# EasyEDA Pro project ActiveMoCapDeck.eprj

# Schematic ActivaMoCapDeck
Board Name: ActiveMoCapDeck; Create Date: 2024-09-30; Page Name: sch_1; Project Name: ActiveMoCapDeck_shrink; Schematic Name: ActivaMoCapDeck; Update Date: 2024-10-02
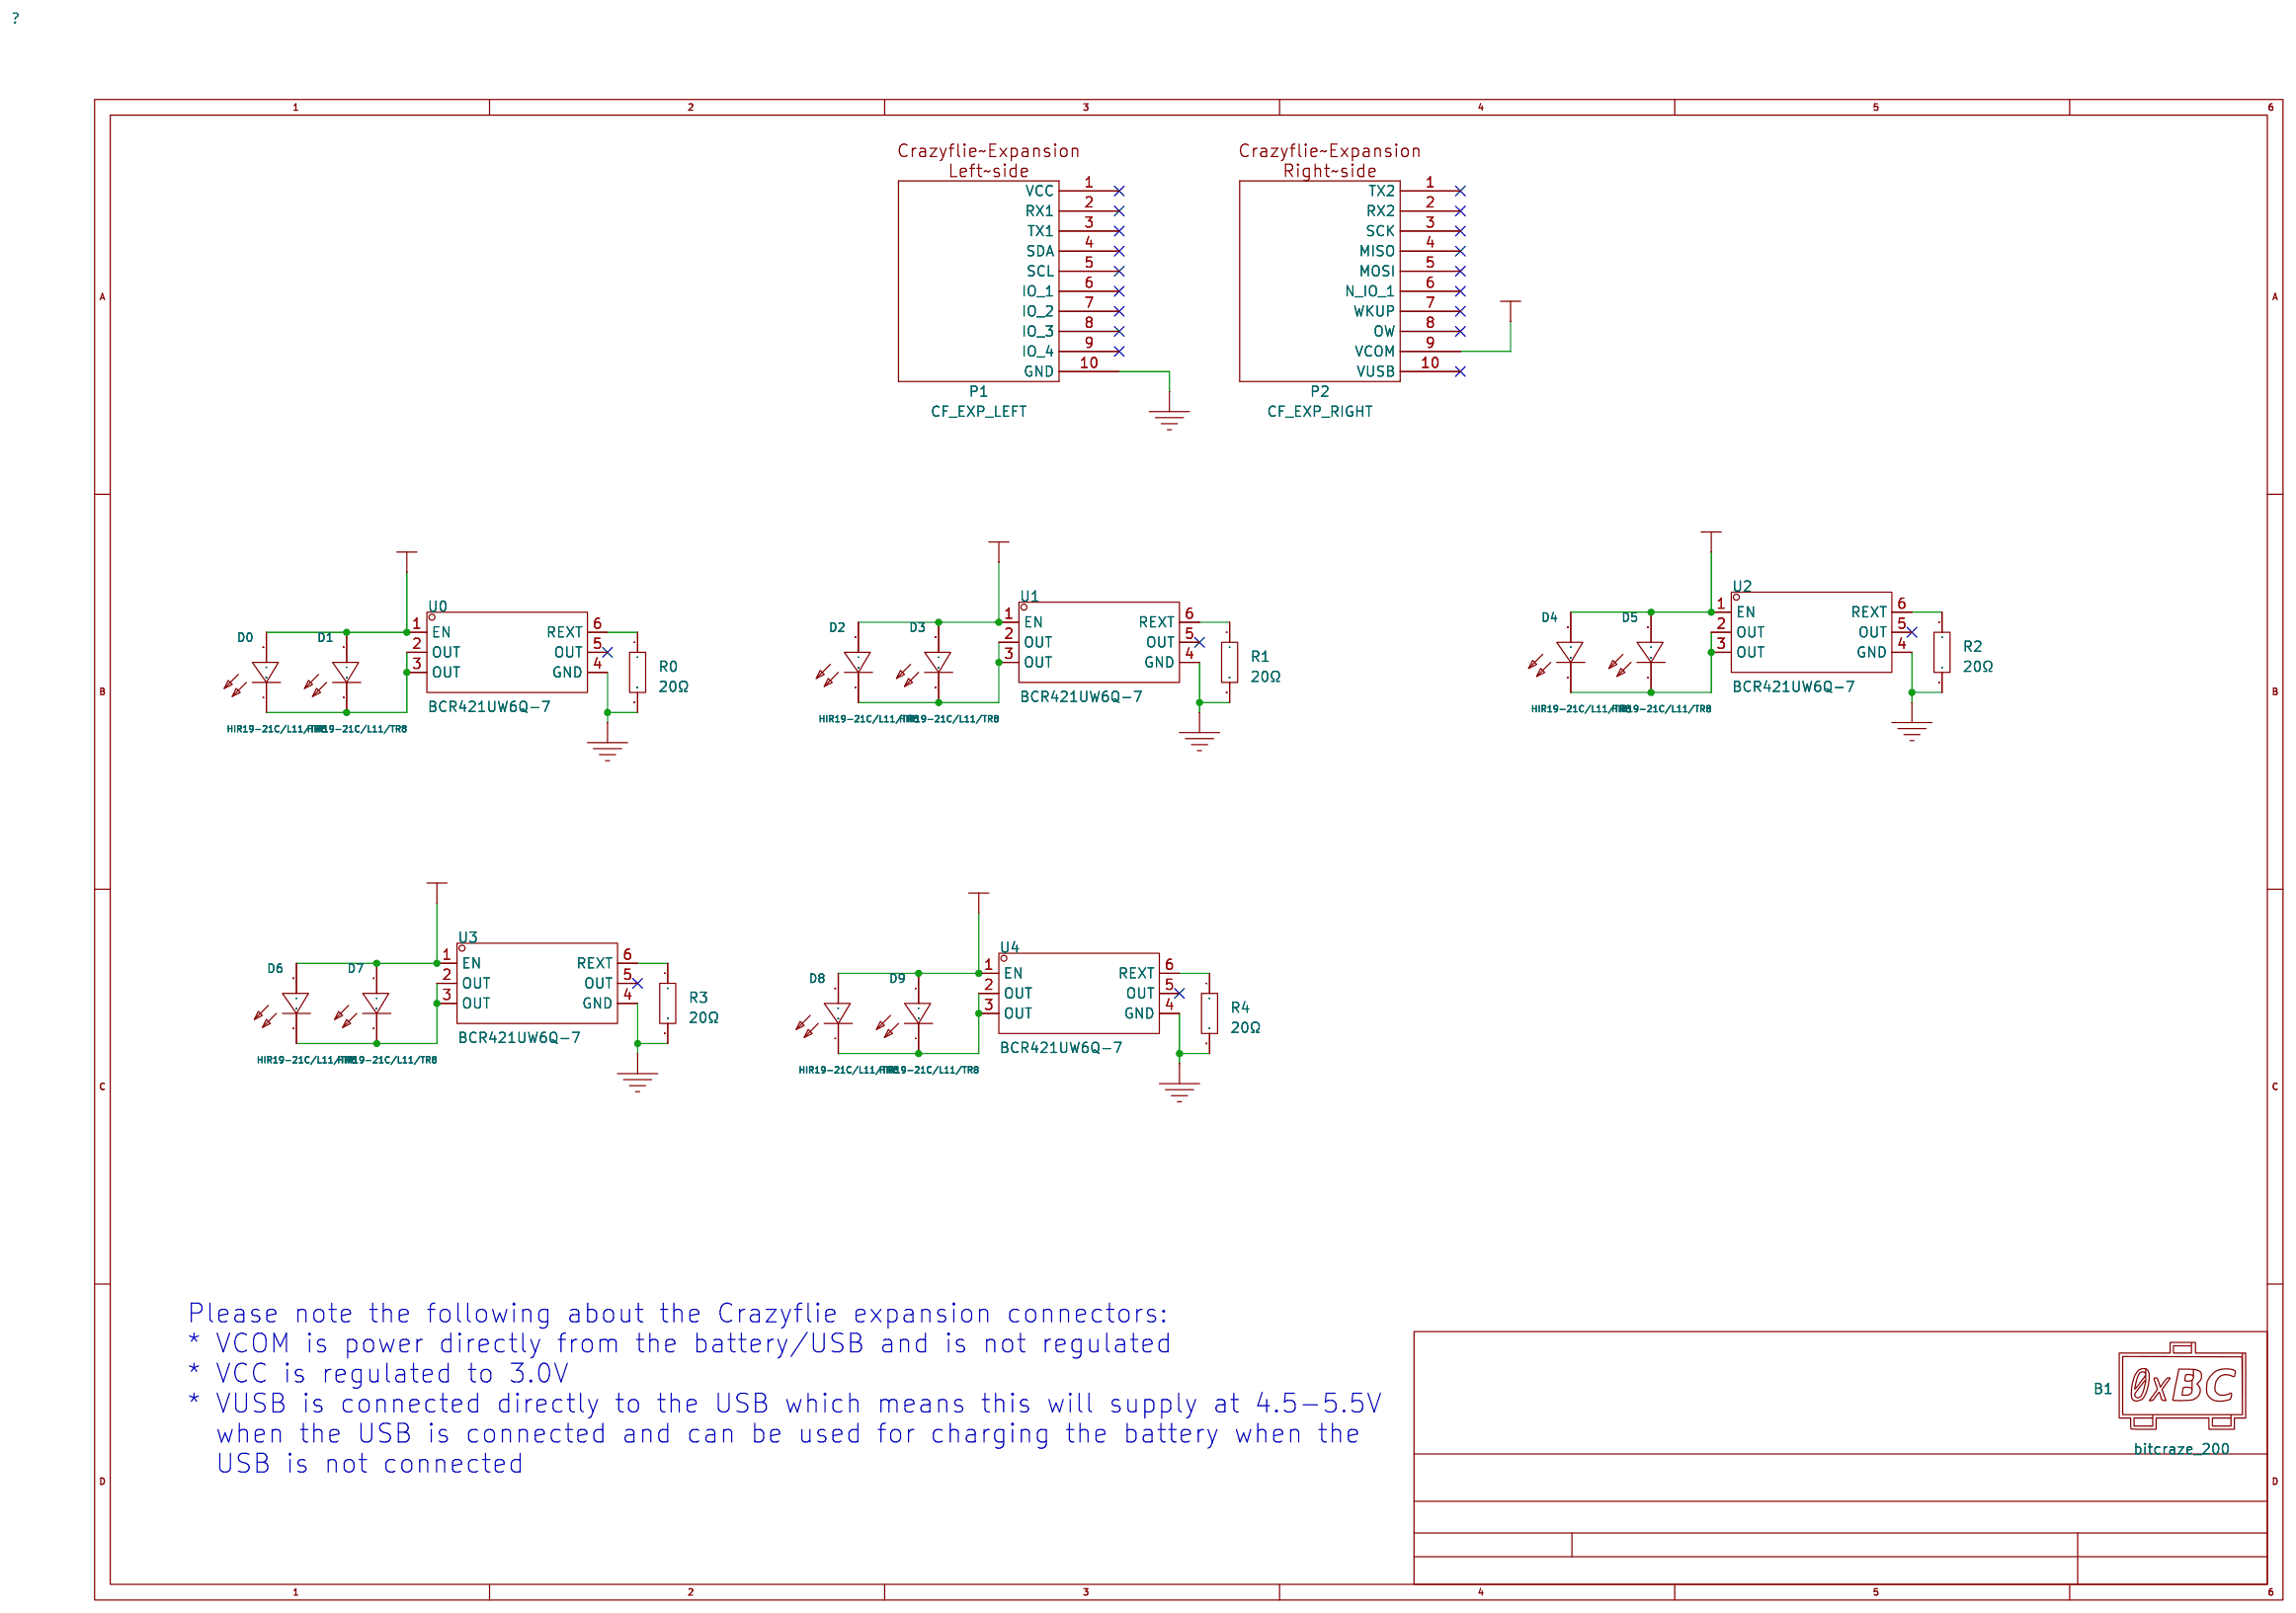
[diagram p0: schematic sheet]

## Parts
B1  bitcraze_200  [bitcraze:EXP_ORIENTATION]
D0  HIR19-21C/L11/TR8  [LED0603-RD]
D1  HIR19-21C/L11/TR8  [LED0603-RD]
D2  HIR19-21C/L11/TR8  [LED0603-RD]
D3  HIR19-21C/L11/TR8  [LED0603-RD]
D4  HIR19-21C/L11/TR8  [LED0603-RD]
D5  HIR19-21C/L11/TR8  [LED0603-RD]
D6  HIR19-21C/L11/TR8  [LED0603-RD]
D7  HIR19-21C/L11/TR8  [LED0603-RD]
D8  HIR19-21C/L11/TR8  [LED0603-RD]
D9  HIR19-21C/L11/TR8  [LED0603-RD]
P1  CF_EXP_LEFT  [connectors:BF090-10-X-B2]
P2  CF_EXP_RIGHT  [connectors:BF090-10-X-B2]
R0  20Ω  [R0603]
R1  20Ω  [R0603]
R2  20Ω  [R0603]
R3  20Ω  [R0603]
R4  20Ω  [R0603]
U0  BCR421UW6Q-7  [SOT-23-6_L2.9-W1.6-P0.95-LS2.8-BR]
U1  BCR421UW6Q-7  [SOT-23-6_L2.9-W1.6-P0.95-LS2.8-BR]
U2  BCR421UW6Q-7  [SOT-23-6_L2.9-W1.6-P0.95-LS2.8-BR]
U3  BCR421UW6Q-7  [SOT-23-6_L2.9-W1.6-P0.95-LS2.8-BR]
U4  BCR421UW6Q-7  [SOT-23-6_L2.9-W1.6-P0.95-LS2.8-BR]

## Library data of the parts
B1 = bitcraze_200
D0-D9 = HIR19-21C/L11/TR8: Supplier Part: C114576; Manufacturer: EVERLIGHT(亿光); Supplier Footprint: 0603; JLCPCB Part Class: Extended Part; Datasheet: https://atta.szlcsc.com/upload/public/pdf/source/20180911/C114576_1E29456949A0415C0F48779CCD5309D8.pdf; Supplier: LCSC; Vf - Forward Voltage: 1.45V; Wavelength: 850nm; Radiant Intensity: 0.2mW/sr@20mA; View Angle: 145°; Operating Temperature: -25℃~+85℃
P1 = CF_EXP_LEFT: Library Name: *
P2 = CF_EXP_RIGHT: Library Name: *
R0-R4 = RC0603JR-0720RL: LCSC Part Name: 厚膜电阻 20Ω ±5% 100mW; Supplier Part: C137648; Manufacturer: YAGEO(国巨); Supplier Footprint: 0603; JLCPCB Part Class: Extended Part; Datasheet: https://atta.szlcsc.com/upload/public/pdf/source/20180821/C275644_0D56F95EFF785E7D9A1FEF436B37DA78.pdf; Supplier: LCSC; Type: 厚膜电阻; Tolerance: ±5%; Power(Watts): 100mW; Overload Voltage (Max): 75V; Temperature Coefficient: ±100ppm/℃; Operating Temperature Range: -55℃~+155℃
U0-U4 = BCR421UW6Q-7: LCSC Part Name: 输出350mA; Supplier Part: C154739; Manufacturer: DIODES(美台); Supplier Footprint: SOT-26; JLCPCB Part Class: Extended Part; Datasheet: https://atta.szlcsc.com/upload/public/pdf/source/20171221/C154739_15138395220401195838.pdf; Supplier: LCSC; Input Voltage: 18V; Channels: 1; Output Voltage: 40V; Output Current: 350mA; Dimming: PWM; Operating temperature: -55℃~+150℃

## Nets
GND: P1.10(GND) R0.2 R1.2 R2.2 R3.2 R4.2 U0.4(GND) U1.4(GND) U2.4(GND) U3.4(GND) U4.4(GND)
VCOM: D0.2(A) D1.2(A) D2.2(A) D3.2(A) D4.2(A) D5.2(A) D6.2(A) D7.2(A) D8.2(A) D9.2(A) P2.9(VCOM) U0.1(EN) U1.1(EN) U2.1(EN) U3.1(EN) U4.1(EN)
$1N11387: R0.1 U0.6(REXT)
$1N11538: D0.1(C) D1.1(C) U0.2(OUT) U0.3(OUT)
$1N12537: D2.1(C) D3.1(C) U1.2(OUT) U1.3(OUT)
$1N12546: R1.1 U1.6(REXT)
$1N12735: D4.1(C) D5.1(C) U2.2(OUT) U2.3(OUT)
$1N12744: R2.1 U2.6(REXT)
$1N12933: D6.1(C) D7.1(C) U3.2(OUT) U3.3(OUT)
$1N12942: R3.1 U3.6(REXT)
$1N13131: D8.1(C) D9.1(C) U4.2(OUT) U4.3(OUT)
$1N13140: R4.1 U4.6(REXT)

Not connected (* = marked no-connect by the designer): P1 1(VCC)* 2(RX1)* 3(TX1)* 4(SDA)* 5(SCL)* 6(IO_1)* 7(IO_2)* 8(IO_3)* 9(IO_4)*; P2 1(TX2)* 2(RX2)* 3(SCK)* 4(MISO)* 5(MOSI)* 6(N_IO_1)* 7(WKUP)* 8(OW)* 10(VUSB)*; U0 5(OUT)*; U1 5(OUT)*; U2 5(OUT)*; U3 5(OUT)*; U4 5(OUT)*

## Notes on the sheet
- Please note the following about the Crazyflie expansion connectors:
  * VCOM is power directly from the battery/USB and is not regulated
  * VCC is regulated to 3.0V
  * VUSB is connected directly to the USB which means this will supply at 4.5-5.5V
    when the USB is connected and can be used for charging the battery when the
    USB is not connected

# Board pcb
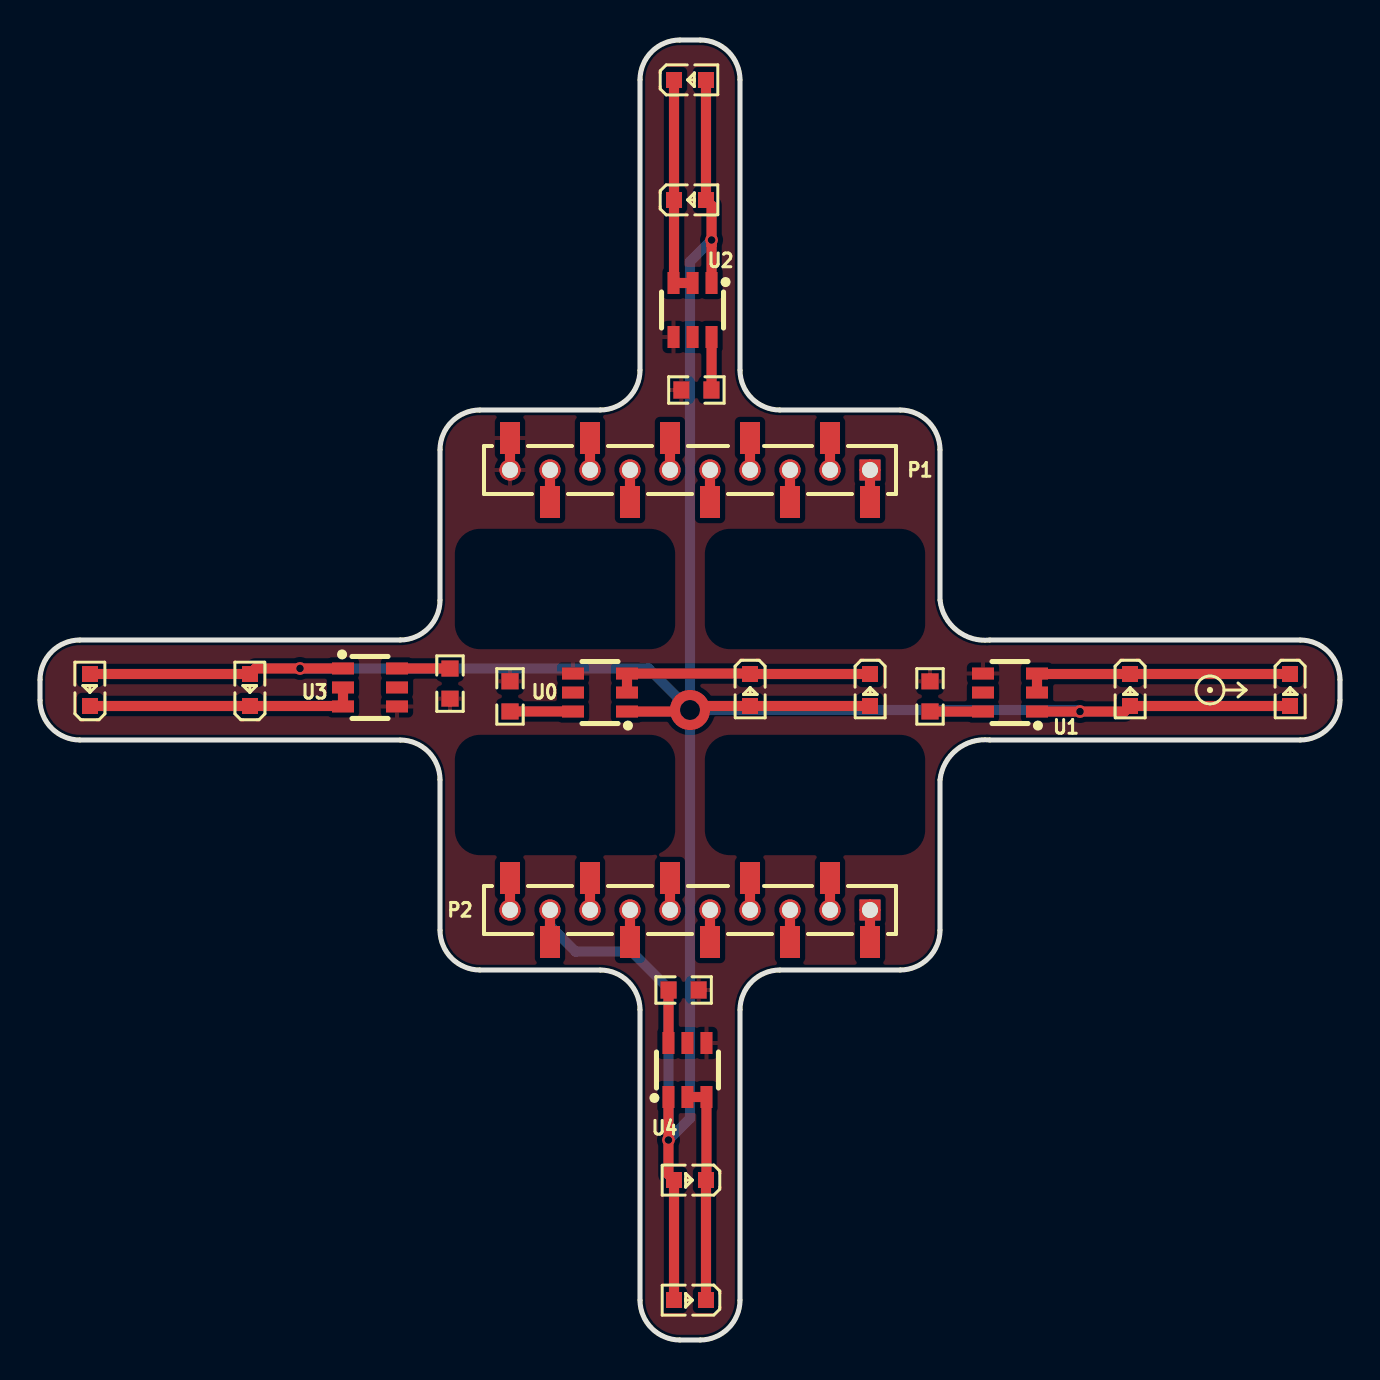
[diagram p1: board, top side]
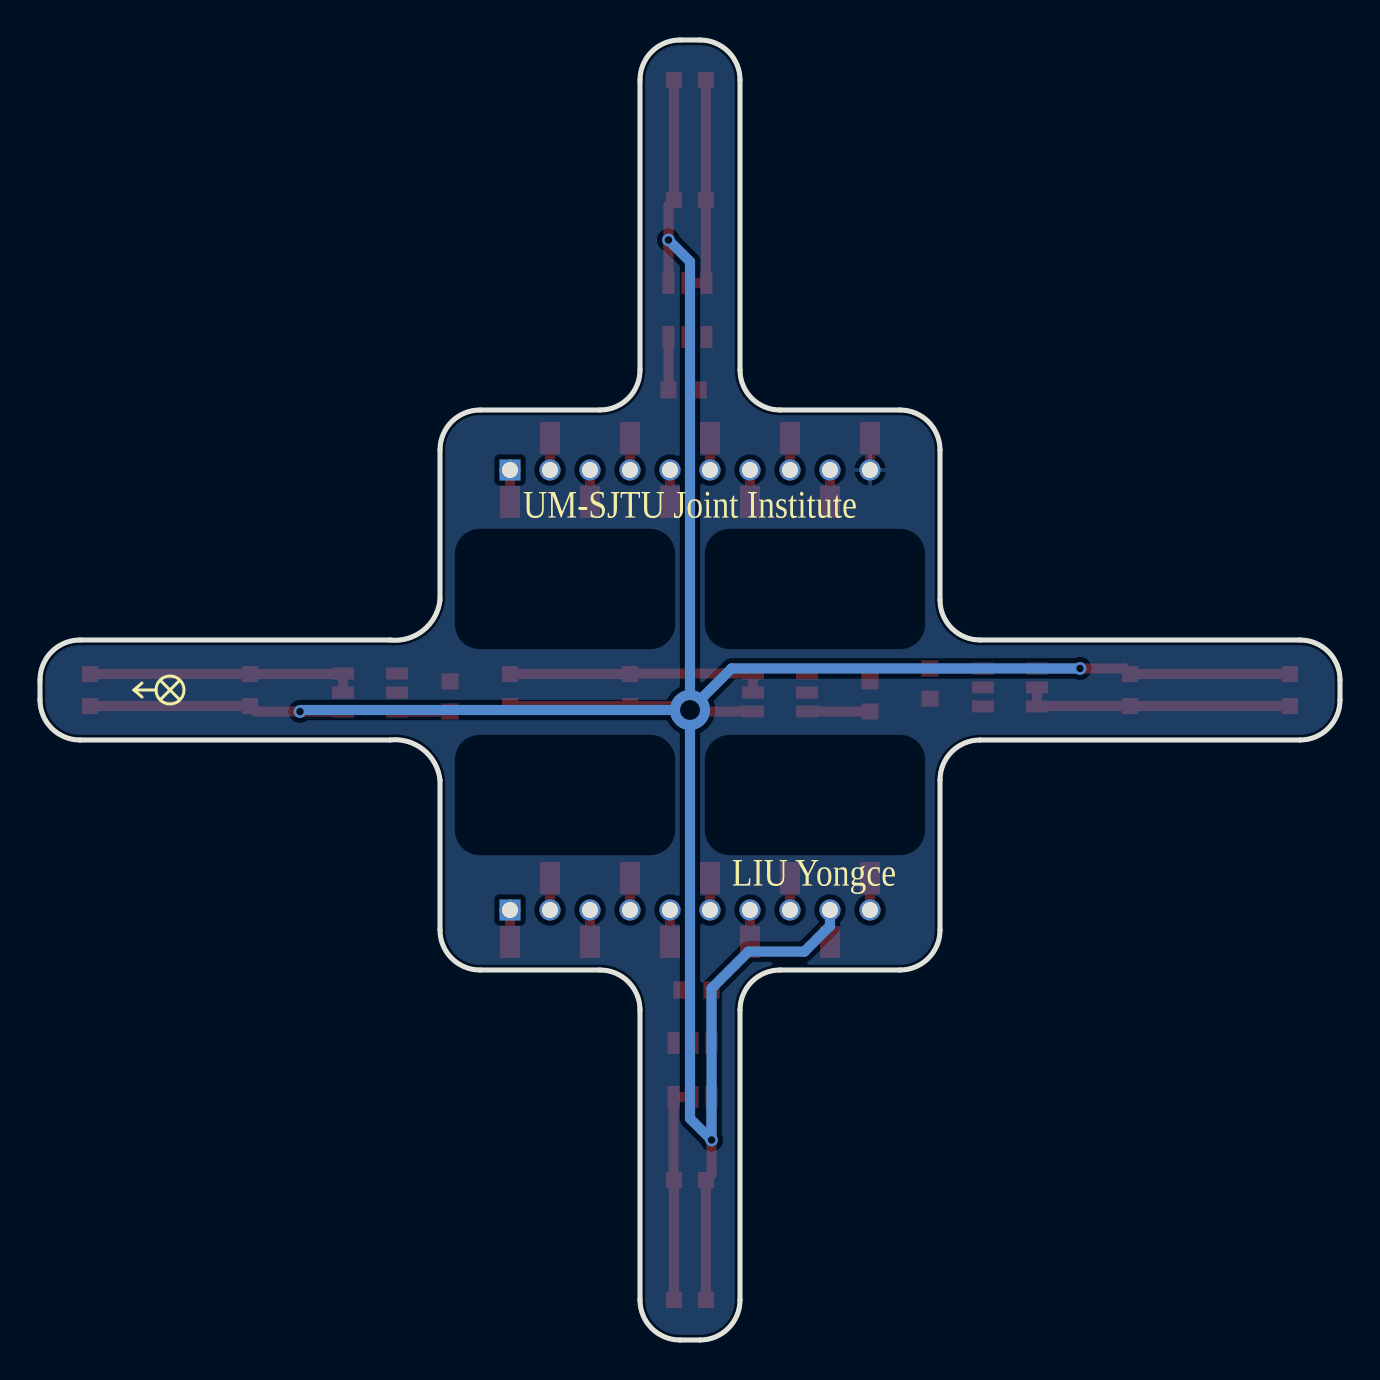
[diagram p2: board, bottom side, seen from below]

Outline 65 x 65 mm; copper layers: Top Layer, Bottom Layer. Coordinates in mm from the lower left corner of the outline.
Outline path: 0,33 arc(0.59,34.41) 2,35 18,35 arc(19.41,35.59) 20,37 20,44.5 arc(20.59,45.91) 22,46.5 28,46.5 arc(29.41,47.09) 30,48.5 30,63 arc(30.59,64.41) 32,65 33,65 arc(34.41,64.41) 35,63 35,48.5 arc(35.59,47.09) 37,46.5 43,46.5 arc(44.41,45.91) 45,44.5 45,37 arc(45.84,35.48) 47.5,35 63,35 arc(64.41,34.41) 65,33 65,32 arc(64.41,30.59) 63,30 47.5,30 arc(45.84,29.52) 45,28 45,20.5 arc(44.41,19.09) 43,18.5 37,18.5 arc(35.59,17.91) 35,16.5 35,2 arc(34.41,0.59) 33,0 32,0 arc(30.59,0.59) 30,2 30,16.5 arc(29.41,17.91) 28,18.5 22,18.5 arc(20.59,19.09) 20,20.5 20,28 arc(19.41,29.41) 18,30 2,30 arc(0.59,30.59) 0,32 0,33
Stack: Top Layer 0.035mm / Dielectric1 1.51mm FR4 er 4.5 / Bottom Layer 0.035mm

## Design rules (mm)
spacing Default (default): track to track 0.152, other pairs 0 to 0.152
track width Default (default): min 0.203, default 0.203, max 2.54
differential pair Default (default): width min 0, default 0, max 2.54; gap min 0, default 0
via Default (default): diameter min 0.635, default 0.635, max 10.003; hole min 0.381, default 0.381, max 5.999

## Placement (name value [footprint] x y rotation side)
B1  bitcraze_200  [bitcraze:EXP_ORIENTATION]  58.5 32.5 0 top
D0  HIR19-21C/L11/TR8  [LED0603-RD]  41.5 32.5 270 top
D1  HIR19-21C/L11/TR8  [LED0603-RD]  35.5 32.5 270 top
D2  HIR19-21C/L11/TR8  [LED0603-RD]  62.5 32.5 270 top
D3  HIR19-21C/L11/TR8  [LED0603-RD]  54.5 32.5 270 top
D4  HIR19-21C/L11/TR8  [LED0603-RD]  32.5 63 0 top
D5  HIR19-21C/L11/TR8  [LED0603-RD]  32.5 57 0 top
D6  HIR19-21C/L11/TR8  [LED0603-RD]  2.5 32.5 90 top
D7  HIR19-21C/L11/TR8  [LED0603-RD]  10.5 32.5 90 top
D8  HIR19-21C/L11/TR8  [LED0603-RD]  32.5 2 180 top
D9  HIR19-21C/L11/TR8  [LED0603-RD]  32.5 8 180 top
P1  CF_EXP_LEFT  [connectors:BF090-10-X-B2]  32.5 43.5 180 top
P2  CF_EXP_RIGHT  [connectors:BF090-10-X-B2]  32.5 21.5 180 top
R0  20Ω  [R0603]  23.5 32.18 90 top
R1  20Ω  [R0603]  44.5 32.18 90 top
R2  20Ω  [R0603]  32.82 47.5 180 top
R3  20Ω  [R0603]  20.5 32.82 270 top
R4  20Ω  [R0603]  32.18 17.5 0 top
U0  BCR421UW6Q-7  [SOT-23-6_L2.9-W1.6-P0.95-LS2.8-BR]  28 32.37 0 top
U1  BCR421UW6Q-7  [SOT-23-6_L2.9-W1.6-P0.95-LS2.8-BR]  48.5 32.37 0 top
U2  BCR421UW6Q-7  [SOT-23-6_L2.9-W1.6-P0.95-LS2.8-BR]  32.63 51.5 90 top
U3  BCR421UW6Q-7  [SOT-23-6_L2.9-W1.6-P0.95-LS2.8-BR]  16.5 32.63 180 top
U4  BCR421UW6Q-7  [SOT-23-6_L2.9-W1.6-P0.95-LS2.8-BR]  32.37 13.5 270 top

## Footprints (pads in the part's own frame, mm; a bottom-side part is the same pattern mirrored in y, then rotated)
connectors:BF090-10-X-B2
  rect 1x1.6 smd: 1(-9,1.6) 2(-7,-1.6) 3(-5,1.6) 4(-3,-1.6) 5(-1,1.6) 6(1,-1.6) 7(3,1.6) 8(5,-1.6) 9(7,1.6) 10(9,-1.6)
  round 1.05 smd: 1(-9,0) 2(-7,0) 3(-5,0) 4(-3,0) 5(-1,0) 6(1,0) 7(3,0) 8(5,0) 9(7,0) 10(9,0)
  rect 1.05x1.05 hole 0.8: 1(-9,0)
  round 1.05 hole 0.8: 2(-7,0) 3(-5,0) 4(-3,0) 5(-1,0) 6(1,0) 7(3,0) 8(5,0) 9(7,0) 10(9,0)
LED0603-RD
  rect 0.8x0.8 smd: 1(-0.799,0) 2(0.799,0)
R0603
  rect 0.806x0.864 smd: 1(-0.753,0) 2(0.753,0)
SOT-23-6_L2.9-W1.6-P0.95-LS2.8-BR
  rect 1.1x0.6 smd: 1(1.35,-0.95) 2(1.35,0) 3(1.35,0.95) 4(-1.35,0.95) 5(-1.35,0) 6(-1.35,-0.95)

## Nets
As in the schematic.

Pads without a net: P1 1 2 3 4 5 6 7 8 9; P2 1 2 3 4 5 6 7 8 10; U0 5; U1 5; U2 5; U3 5; U4 5

## Via types
v1: diameter 0.635, hole 0.381, Top Layer to Bottom Layer, 4 vias
v2: diameter 2, hole 1, Top Layer to Bottom Layer, 1 via

## Routing (per net, layer and track width the routed paths; a pad name or vN(x,y) marks a point on that pad's centre or on a via; arc(x,y) is an arc through that point)
GND: length 1.6
  Top Layer w0.508: P1.10 P1.10
(no net): length 28.8
  Top Layer w0.508: P2.3 P2.3 ; P1.8 P1.8 ; P1.4 P1.4 ; P2.1 P2.1 ; P2.6 P2.6 ; P2.2 P2.2 ; P1.1 P1.1 ; P2.5 P2.5 ; P1.5 P1.5 ; P1.7 P1.7 ; P2.7 P2.7 ; P1.6 P1.6 ; P1.2 P1.2 ; P1.9 P1.9 ; P2.4 P2.4 ; P2.10 P2.10 ; P1.3 P1.3 ; P2.8 P2.8
VCOM: length 161.3
  Top Layer w0.508: D4.2 D5.2 33.58,56.72 U2.1 ; U1.1 v1(52,31.42) 54.22,31.42 D3.2 D2.2 ; D8.2 D9.2 31.42,8.28 U4.1 ; U0.1 32.42,31.42 v2(32.5,31.5) 32.7,31.7 D1.2 D0.2 ; P2.9 P2.9 ; D6.2 D7.2 10.78,33.58 U3.1
  Bottom Layer w0.508: v2(32.5,31.5) 32.5,53.92 v1(33.58,55) ; v2(32.5,31.5) 32.5,11.08 v1(31.42,10) 31.42,17.58 29.58,19.42 26.78,19.42 25.5,20.7 P2.9 ; v2(32.5,31.5) 30.42,33.58 v1(13,33.58) ; v2(32.5,31.5) 51.92,31.5 v1(52,31.42)
$1N11387: length 3.2
  Top Layer w0.508: U0.6 26.65,31.43 R0.1
$1N11538: length 13.1
  Top Layer w0.508: D0.1 D1.1 35.48,33.32 U0.3 U0.2
$1N12537: length 13.6
  Top Layer w0.508: U1.2 U1.3 49.87,33.3 D3.1 D2.1
$1N12546: length 2.7
  Top Layer w0.508: U1.6 44.5,31.42 R1.1
$1N12735: length 11.1
  Top Layer w0.508: D4.1 D5.1 31.7,52.87 31.68,52.85 U2.2
$1N12744: length 2.7
  Top Layer w0.508: R2.1 33.58,47.5 U2.6
$1N12933: length 13.6
  Top Layer w0.508: D6.1 D7.1 15.13,31.7 U3.3 U3.2
$1N12942: length 2.7
  Top Layer w0.508: U3.6 20.5,33.58 R3.1
$1N13131: length 11.1
  Top Layer w0.508: U4.2 33.32,12.15 33.32,8.02 D9.1 D8.1
$1N13140: length 2.7
  Top Layer w0.508: R4.1 31.43,14.85 U4.6

## Copper pours and planes (outline as drawn; the poured copper is in the pictures)
GND on Top Layer: -1.21,66.28 66.79,66.28 66.79,-1.72 -1.21,-1.72
GND on Bottom Layer: -0.83,67.17 67.17,67.17 67.17,-0.83 -0.83,-0.83

## Text on the board
Bottom Silkscreen Layer: LIU Yongce | UM-SJTU Joint Institute
Document Layer: M1 | M4 | M3 | M2 | ANT | Crazyflie 2.0 | uUSB / TOP | BAT | SWD / BOTTOM | BTN | Bitcraze
